# Altium schematic sheet LM2575D2T.SchDoc
size A4
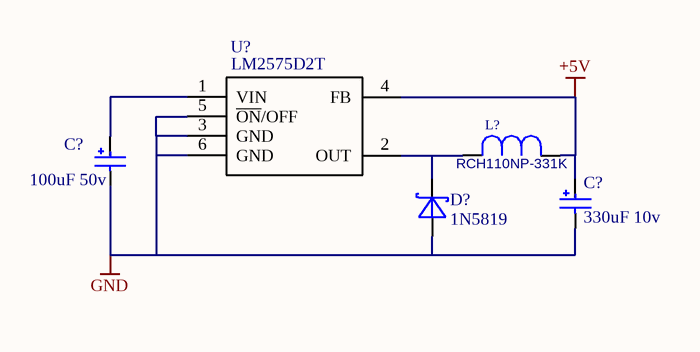
[diagram p0: LM2575D2T.SchDoc]

## Parts
(Parts that share a designator on the sheet are numbered #1, #2 ... from top to bottom, then left to right.)
C?#1  value 100uF 50v  [10x16]  (hidden comment: Cap_Polar)
C?#2  value 330uF 10v  [10x16]  (hidden comment: Cap_Polar)
D?  1N5819  [DO-41]
L?  RCH110NP-331K  [RCH-110]
U?  LM2575D2T  [D2PAK_5p]

## Nets
+5V: C?#2.1 L?.1 U?.4(FB)
GND: C?#1.2 C?#2.2 D?.1(A) U?.3(GND) U?.5(~{ON}/OFF) U?.6(GND)
NetC?#1_1: C?#1.1 U?.1(VIN)
NetD?_2: D?.2(C) L?.2 U?.2(OUT)

## Library data of the parts
C?#1 C?#2 = Cap_Polar: Capacitor Polar
D? = 1N5819: Diode schottky
L? = Inductor: Value: RCH110NP-331K
U? = LM2575D2T-3.3: Easy Switcher 1.0A Step-Down Voltage Regulator